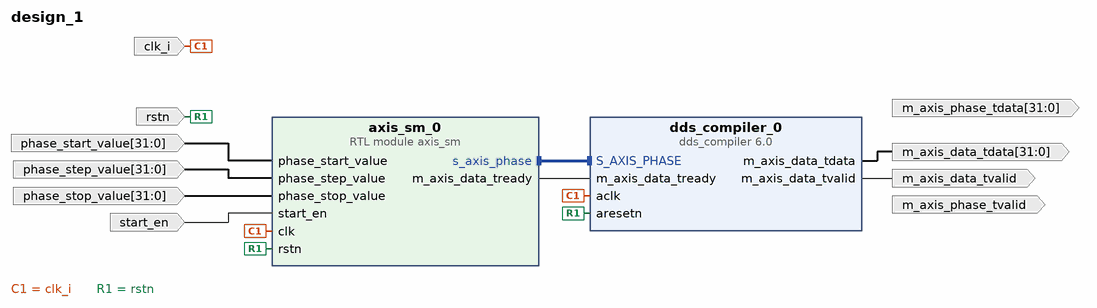
[diagram p0: block diagram of the top level]
# Vivado block design design_1, xc7vx485tffg1157-1, Vivado 2024.2
create_bd_design design_1

create_bd_port -dir I -type rst rstn
create_bd_port -dir I -type clk clk_i
set_property -dict {CONFIG.FREQ_HZ 100000000} [get_bd_ports clk_i]
create_bd_port -dir O -from 31 -to 0 m_axis_data_tdata
create_bd_port -dir O m_axis_data_tvalid
create_bd_port -dir O -from 31 -to 0 m_axis_phase_tdata
create_bd_port -dir O m_axis_phase_tvalid
create_bd_port -dir I -from 31 -to 0 phase_start_value
create_bd_port -dir I -from 31 -to 0 phase_stop_value
create_bd_port -dir I -from 31 -to 0 phase_step_value
create_bd_port -dir I start_en

create_bd_cell -type ip -vlnv xilinx.com:ip:dds_compiler:6.0 dds_compiler_0
set_property -dict [list \
  CONFIG.Amplitude_Mode Unit_Circle \
  CONFIG.Channels 1 \
  CONFIG.DATA_Has_TLAST Not_Required \
  CONFIG.Frequency_Resolution 0.4 \
  CONFIG.Has_ARESETn true \
  CONFIG.Has_Phase_Out false \
  CONFIG.Has_TREADY true \
  CONFIG.Latency 13 \
  CONFIG.Latency_Configuration Auto \
  CONFIG.M_DATA_Has_TUSER Not_Required \
  CONFIG.M_PHASE_Has_TUSER Not_Required \
  CONFIG.Mode_of_Operation Standard \
  CONFIG.Noise_Shaping None \
  CONFIG.OUTPUT_FORM Twos_Complement \
  CONFIG.Output_Frequency1 0 \
  CONFIG.Output_Selection Sine_and_Cosine \
  CONFIG.Output_Width 16 \
  CONFIG.PINC1 0 \
  CONFIG.Parameter_Entry Hardware_Parameters \
  CONFIG.PartsPresent Phase_Generator_and_SIN_COS_LUT \
  CONFIG.Phase_Increment Streaming \
  CONFIG.Phase_Width 32 \
  CONFIG.Phase_offset None \
  CONFIG.S_PHASE_Has_TUSER Not_Required \
] [get_bd_cells dds_compiler_0]
create_bd_cell -type module -reference axis_sm axis_sm_0

# ---- connections ----

connect_bd_intf_net [get_bd_intf_pins axis_sm_0/s_axis_phase] [get_bd_intf_pins dds_compiler_0/S_AXIS_PHASE]
connect_bd_net [get_bd_pins axis_sm_0/m_axis_data_tready] [get_bd_pins dds_compiler_0/m_axis_data_tready]
connect_bd_net [get_bd_ports clk_i] [get_bd_pins dds_compiler_0/aclk] [get_bd_pins axis_sm_0/clk]
connect_bd_net [get_bd_pins dds_compiler_0/m_axis_data_tdata] [get_bd_ports m_axis_data_tdata]
connect_bd_net [get_bd_pins dds_compiler_0/m_axis_data_tvalid] [get_bd_ports m_axis_data_tvalid]
connect_bd_net [get_bd_ports phase_start_value] [get_bd_pins axis_sm_0/phase_start_value]
connect_bd_net [get_bd_ports phase_step_value] [get_bd_pins axis_sm_0/phase_step_value]
connect_bd_net [get_bd_ports phase_stop_value] [get_bd_pins axis_sm_0/phase_stop_value]
connect_bd_net [get_bd_ports rstn] [get_bd_pins dds_compiler_0/aresetn] [get_bd_pins axis_sm_0/rstn]
connect_bd_net [get_bd_ports start_en] [get_bd_pins axis_sm_0/start_en]

validate_bd_design
save_bd_design
